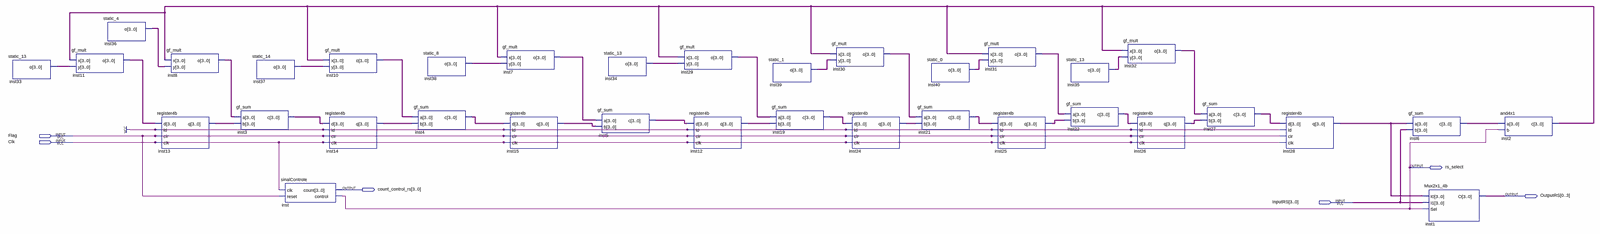
[diagram p0: schematic sheet, whole]
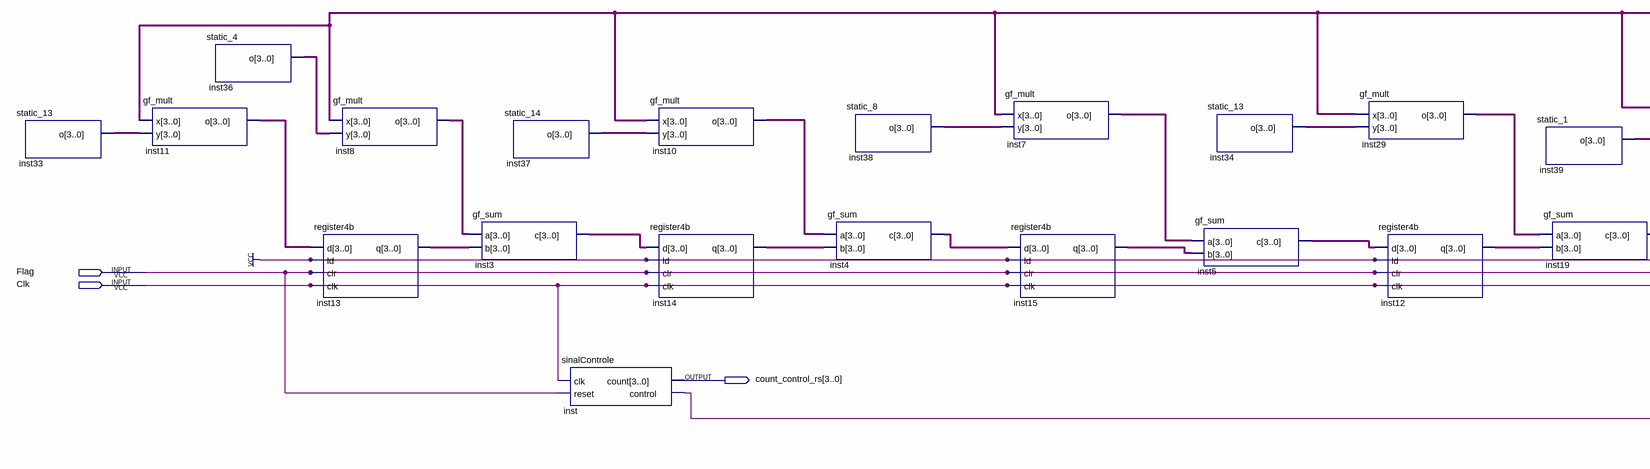
[diagram p1: schematic sheet, left part]
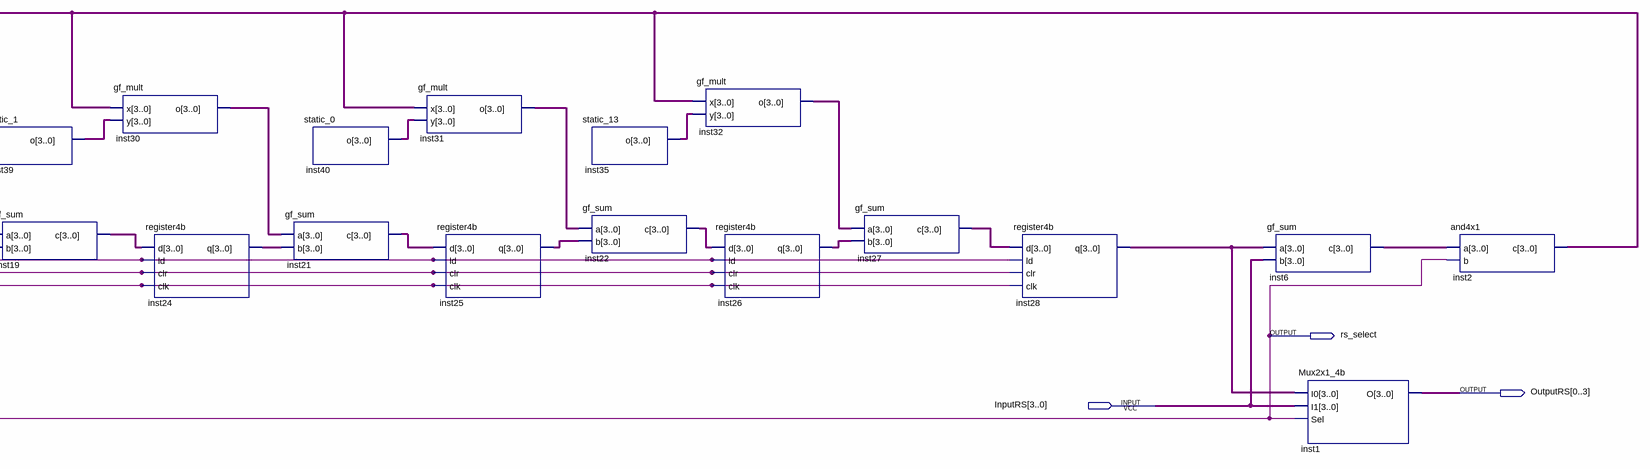
[diagram p2: schematic sheet, right part]
// Quartus schematic RSencoder.bdf as structural Verilog: 35 symbols, 6 pins
module RSencoder (
  input  Flag,
  input  Clk,
  input  [3:0] InputRS,
  output rs_select,
  output [3:0] count_control_rs,
  output [0:3] OutputRS
);

  wire [3:0] inst2_c, inst3_c, inst4_c, inst5_c, inst6_c, inst7_o, inst8_o, inst10_o, inst11_o, inst12_q,
       inst13_q, inst14_q, inst15_q, inst19_c, inst21_c, inst22_c, inst24_q, inst25_q, inst26_q, inst27_c,
       inst28_q, inst29_o, inst30_o, inst31_o, inst32_o, inst33_o, inst34_o, inst35_o, inst36_o, inst37_o,
       inst38_o, inst39_o, inst40_o;

  static_13 inst33 (.o(inst33_o));
  gf_mult inst11 (.x(inst2_c), .y(inst33_o), .o(inst11_o));
  static_4 inst36 (.o(inst36_o));
  gf_mult inst8 (.x(inst2_c), .y(inst36_o), .o(inst8_o));
  register4b inst13 (.d(inst11_o), .ld(1'b1), .clr(Flag), .clk(Clk), .q(inst13_q));
  gf_sum inst3 (.a(inst8_o), .b(inst13_q), .c(inst3_c));
  static_14 inst37 (.o(inst37_o));
  sinalControle inst (.clk(Clk), .reset(Flag), .count(count_control_rs), .control(rs_select));
  gf_mult inst10 (.x(inst2_c), .y(inst37_o), .o(inst10_o));
  register4b inst14 (.d(inst3_c), .ld(1'b1), .clr(Flag), .clk(Clk), .q(inst14_q));
  gf_sum inst4 (.a(inst10_o), .b(inst14_q), .c(inst4_c));
  static_8 inst38 (.o(inst38_o));
  gf_mult inst7 (.x(inst2_c), .y(inst38_o), .o(inst7_o));
  register4b inst15 (.d(inst4_c), .ld(1'b1), .clr(Flag), .clk(Clk), .q(inst15_q));
  gf_sum inst5 (.a(inst7_o), .b(inst15_q), .c(inst5_c));
  static_13 inst34 (.o(inst34_o));
  gf_mult inst29 (.x(inst2_c), .y(inst34_o), .o(inst29_o));
  register4b inst12 (.d(inst5_c), .ld(1'b1), .clr(Flag), .clk(Clk), .q(inst12_q));
  static_1 inst39 (.o(inst39_o));
  gf_sum inst19 (.a(inst29_o), .b(inst12_q), .c(inst19_c));
  gf_mult inst30 (.x(inst2_c), .y(inst39_o), .o(inst30_o));
  register4b inst24 (.d(inst19_c), .ld(1'b1), .clr(Flag), .clk(Clk), .q(inst24_q));
  static_0 inst40 (.o(inst40_o));
  gf_sum inst21 (.a(inst30_o), .b(inst24_q), .c(inst21_c));
  gf_mult inst31 (.x(inst2_c), .y(inst40_o), .o(inst31_o));
  register4b inst25 (.d(inst21_c), .ld(1'b1), .clr(Flag), .clk(Clk), .q(inst25_q));
  static_13 inst35 (.o(inst35_o));
  gf_sum inst22 (.a(inst31_o), .b(inst25_q), .c(inst22_c));
  gf_mult inst32 (.x(inst2_c), .y(inst35_o), .o(inst32_o));
  register4b inst26 (.d(inst22_c), .ld(1'b1), .clr(Flag), .clk(Clk), .q(inst26_q));
  gf_sum inst27 (.a(inst32_o), .b(inst26_q), .c(inst27_c));
  register4b inst28 (.d(inst27_c), .ld(1'b1), .clr(Flag), .clk(Clk), .q(inst28_q));
  gf_sum inst6 (.a(inst28_q), .b(InputRS), .c(inst6_c));
  Mux2x1_4b inst1 (.I0(inst28_q), .I1(InputRS), .Sel(rs_select), .O(OutputRS));
  and4x1 inst2 (.a(inst6_c), .b(rs_select), .c(inst2_c));
endmodule
